# Altium schematic sheet USB转9线串口.SchDoc: USB转9线串口
size A4; DrawnBy: Athurg; DocumentNumber: 1; SheetNumber: 1
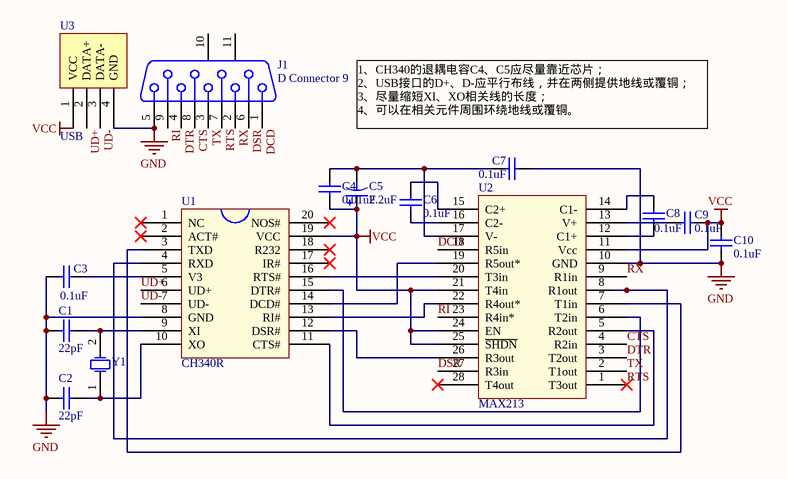
[diagram p0: USB转9线串口.SchDoc]

## Parts
C1  value 22pF  [C1206]
C2  value 22pF  [C1206]
C3  value 0.1uF  [C1206]
C4  value 0.01uF  [C1206]
C5  value 2.2uF  [C1206]  (hidden comment: Cap Pol1)
C6  value 0.1uF  [C1206]
C7  value 0.1uF  [C1206]
C8  value 0.1uF  [C1206]
C9  value 0.1uF  [C1206]
C10  value 0.1uF  [C1206]
J1  D Connector 9  [DSUB1.385-2H9]
U1  CH340R  [SSOP-20]
U2  MAX213  [SSOP-28]
U3  USB  [USB-A]
Y1  XTAL  [R38]  (value not drawn)

## Nets
GND: C1.2 C2.2 C3.1 C7.2 C10.1 J1.5 U1.8(GND) U2.10(GND) U3.4(GND)
VCC: C4.1 C5.1 C9.2 C10.2 U1.19(VCC) U2.11(Vcc) U2.21(T4in) U2.24(EN) U2.25(~{SHDN}) U3.1(VCC)
CTS: J1.8 U2.4(R2in)
DCD: J1.1 U2.18(R5in)
DSR: J1.6 U2.27(R3in)
DTR: J1.4 U2.3(T2out)
RI: J1.9 U2.23(R4in*)
RTS: J1.7 U2.1(T3out)
RX: J1.2 U2.9(R1in)
TX: J1.3 U2.2(T1out)
UD+: U1.6(UD+) U3.2(DATA+)
UD-: U1.7(UD-) U3.3(DATA-)
NetC1_1: C1.1 U1.9(XI) Y1.2(OSC2)
NetC2_1: C2.1 U1.10(XO) Y1.1(OSC1)
NetC3_2: C3.2 U1.5(V3)
NetC4_2: C4.2 C5.2 C7.1 U2.17(V-)
NetC6_1: C6.1 U2.16(C2-)
NetC6_2: C6.2 U2.15(C2+)
NetC8_1: C8.1 U2.12(C1+)
NetC8_2: C8.2 U2.14(C1-)
NetC9_1: C9.1 U2.13(V+)
NetU1_3: U1.3(TXD) U2.7(T1in)
NetU1_4: U1.4(RXD) U2.8(R1out)
NetU1_11: U1.11(CTS#) U2.5(R2out)
NetU1_12: U1.12(DSR#) U2.26(R3out)
NetU1_13: U1.13(RI#) U2.22(R4out*)
NetU1_14: U1.14(DCD#) U2.19(R5out*)
NetU1_15: U1.15(DTR#) U2.6(T2in)
NetU1_16: U1.16(RTS#) U2.20(T3in)

Not connected (* = marked no-connect by the designer): J1 10(MH1) 11(MH2); U1 1(NC)* 2(ACT#)* 17(IR#)* 18(R232)* 20(NOS#)*; U2 28(T4out)*; U3 5(NC) 6(NC)

## Notes on the sheet
- 1、CH340的退耦电容C4、C5应尽量靠近芯片；
  2、USB接口的D+、D-应平行布线，并在两侧提供地线或覆铜；
  3、尽量缩短XI、XO相关线的长度；
  4、可以在相关元件周围环绕地线或覆铜。

## Library data of the parts
C1-C4 C6-C10 = Cap: Capacitor; Published: 8-Jun-2000; LatestRevisionDate: 17-Jul-2002; LatestRevisionNote: Re-released for DXP Platform.; PackageReference: RAD-0.3; Publisher: Altium Limited
C5 = Cap Pol1: Polarized Capacitor (Radial); Published: 8-Jun-2000; LatestRevisionDate: 17-Jul-2002; LatestRevisionNote: Re-released for DXP Platform.; PackageReference: RB7.6-15; Publisher: Altium Limited
J1 = D Connector 9: Receptacle Assembly, 9 Position, Right Angle; PackageDocument: O; Positions: 9; Published: 15-Jun-2001; LatestRevisionDate: 17-Jul-2002; LatestRevisionNote: Re-released for DXP Platform.; DatasheetDocument: 1-Sep-1999; PackageReference: 788750; Publisher: Altium Limited; Orientation: Right Angle; Gender: Receptacle
Y1 = XTAL: Crystal Oscillator; Published: 8-Jun-2000; LatestRevisionDate: 17-Jul-2002; LatestRevisionNote: Re-released for DXP Platform.; PackageReference: R38; Publisher: Altium Limited